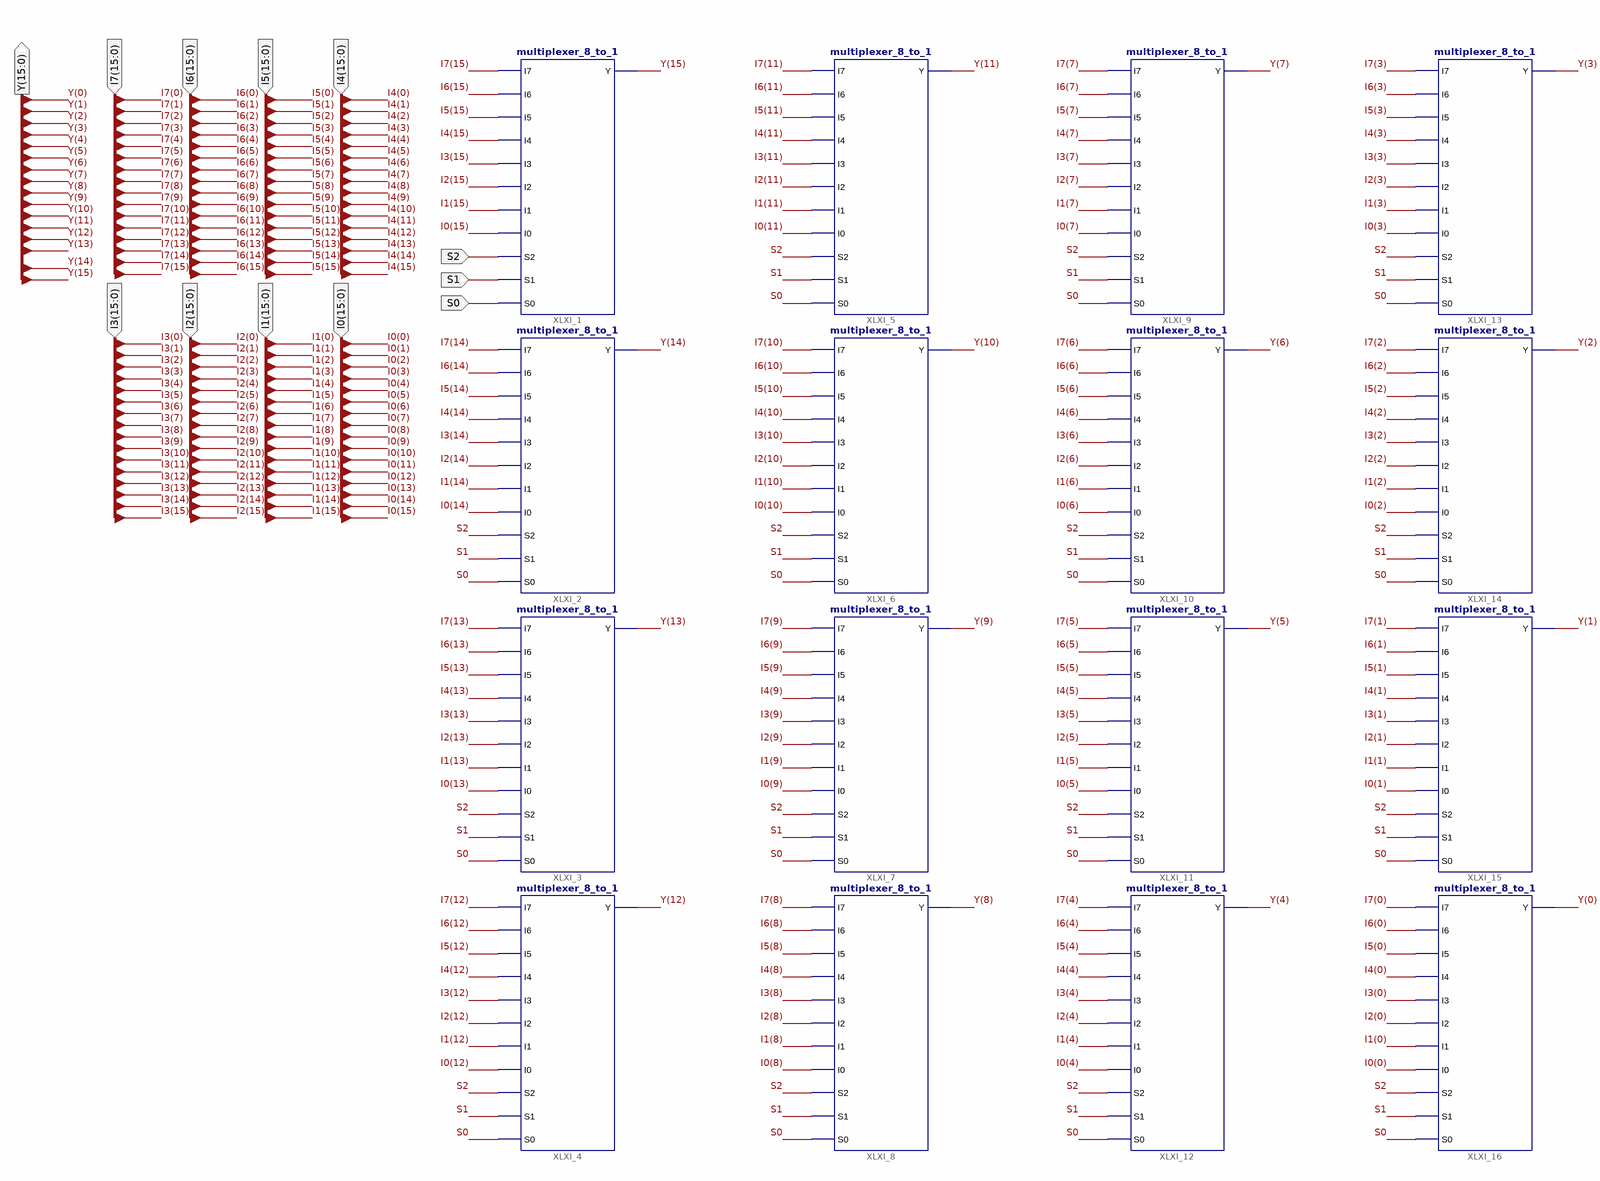
[diagram p0: schematic sheet 1]
// Xilinx ISE schematic multiplexer_8_to_1_16_bit.sch (virtex6) as structural Verilog: 16 symbols, 12 ports
module multiplexer_8_to_1_16_bit (
  input  [15:0] I6,
  input  [15:0] I5,
  input  [15:0] I4,
  input  [15:0] I3,
  input  [15:0] I2,
  input  [15:0] I1,
  input  [15:0] I0,
  input  [15:0] I7,
  input  S2,
  input  S1,
  input  S0,
  output [15:0] Y
);

  multiplexer_8_to_1 XLXI_1 (
    .I0(I0[15]), .I1(I1[15]), .I2(I2[15]), .I3(I3[15]), .I4(I4[15]), .I5(I5[15]), .I6(I6[15]), .I7(I7[15]),
    .S0(S0), .S1(S1), .S2(S2), .Y(Y[15]));
  multiplexer_8_to_1 XLXI_2 (
    .I0(I0[14]), .I1(I1[14]), .I2(I2[14]), .I3(I3[14]), .I4(I4[14]), .I5(I5[14]), .I6(I6[14]), .I7(I7[14]),
    .S0(S0), .S1(S1), .S2(S2), .Y(Y[14]));
  multiplexer_8_to_1 XLXI_3 (
    .I0(I0[13]), .I1(I1[13]), .I2(I2[13]), .I3(I3[13]), .I4(I4[13]), .I5(I5[13]), .I6(I6[13]), .I7(I7[13]),
    .S0(S0), .S1(S1), .S2(S2), .Y(Y[13]));
  multiplexer_8_to_1 XLXI_4 (
    .I0(I0[12]), .I1(I1[12]), .I2(I2[12]), .I3(I3[12]), .I4(I4[12]), .I5(I5[12]), .I6(I6[12]), .I7(I7[12]),
    .S0(S0), .S1(S1), .S2(S2), .Y(Y[12]));
  multiplexer_8_to_1 XLXI_5 (
    .I0(I0[11]), .I1(I1[11]), .I2(I2[11]), .I3(I3[11]), .I4(I4[11]), .I5(I5[11]), .I6(I6[11]), .I7(I7[11]),
    .S0(S0), .S1(S1), .S2(S2), .Y(Y[11]));
  multiplexer_8_to_1 XLXI_6 (
    .I0(I0[10]), .I1(I1[10]), .I2(I2[10]), .I3(I3[10]), .I4(I4[10]), .I5(I5[10]), .I6(I6[10]), .I7(I7[10]),
    .S0(S0), .S1(S1), .S2(S2), .Y(Y[10]));
  multiplexer_8_to_1 XLXI_7 (
    .I0(I0[9]), .I1(I1[9]), .I2(I2[9]), .I3(I3[9]), .I4(I4[9]), .I5(I5[9]), .I6(I6[9]), .I7(I7[9]), .S0(S0),
    .S1(S1), .S2(S2), .Y(Y[9]));
  multiplexer_8_to_1 XLXI_8 (
    .I0(I0[8]), .I1(I1[8]), .I2(I2[8]), .I3(I3[8]), .I4(I4[8]), .I5(I5[8]), .I6(I6[8]), .I7(I7[8]), .S0(S0),
    .S1(S1), .S2(S2), .Y(Y[8]));
  multiplexer_8_to_1 XLXI_9 (
    .I0(I0[7]), .I1(I1[7]), .I2(I2[7]), .I3(I3[7]), .I4(I4[7]), .I5(I5[7]), .I6(I6[7]), .I7(I7[7]), .S0(S0),
    .S1(S1), .S2(S2), .Y(Y[7]));
  multiplexer_8_to_1 XLXI_10 (
    .I0(I0[6]), .I1(I1[6]), .I2(I2[6]), .I3(I3[6]), .I4(I4[6]), .I5(I5[6]), .I6(I6[6]), .I7(I7[6]), .S0(S0),
    .S1(S1), .S2(S2), .Y(Y[6]));
  multiplexer_8_to_1 XLXI_11 (
    .I0(I0[5]), .I1(I1[5]), .I2(I2[5]), .I3(I3[5]), .I4(I4[5]), .I5(I5[5]), .I6(I6[5]), .I7(I7[5]), .S0(S0),
    .S1(S1), .S2(S2), .Y(Y[5]));
  multiplexer_8_to_1 XLXI_12 (
    .I0(I0[4]), .I1(I1[4]), .I2(I2[4]), .I3(I3[4]), .I4(I4[4]), .I5(I5[4]), .I6(I6[4]), .I7(I7[4]), .S0(S0),
    .S1(S1), .S2(S2), .Y(Y[4]));
  multiplexer_8_to_1 XLXI_13 (
    .I0(I0[3]), .I1(I1[3]), .I2(I2[3]), .I3(I3[3]), .I4(I4[3]), .I5(I5[3]), .I6(I6[3]), .I7(I7[3]), .S0(S0),
    .S1(S1), .S2(S2), .Y(Y[3]));
  multiplexer_8_to_1 XLXI_14 (
    .I0(I0[2]), .I1(I1[2]), .I2(I2[2]), .I3(I3[2]), .I4(I4[2]), .I5(I5[2]), .I6(I6[2]), .I7(I7[2]), .S0(S0),
    .S1(S1), .S2(S2), .Y(Y[2]));
  multiplexer_8_to_1 XLXI_15 (
    .I0(I0[1]), .I1(I1[1]), .I2(I2[1]), .I3(I3[1]), .I4(I4[1]), .I5(I5[1]), .I6(I6[1]), .I7(I7[1]), .S0(S0),
    .S1(S1), .S2(S2), .Y(Y[1]));
  multiplexer_8_to_1 XLXI_16 (
    .I0(I0[0]), .I1(I1[0]), .I2(I2[0]), .I3(I3[0]), .I4(I4[0]), .I5(I5[0]), .I6(I6[0]), .I7(I7[0]), .S0(S0),
    .S1(S1), .S2(S2), .Y(Y[0]));
endmodule
